# EasyEDA Pro project RAC_schematic_pcb.epro

# Schematic Schematic1
Board Name: Board1; Create Date: 2025-08-06; Page Name: P1; Project Name: RAC_NEW; Schematic Name: Schematic1; Update Date: 2025-08-06; Company: EasyEDA.com; Page Size: A4; Version: V1.0
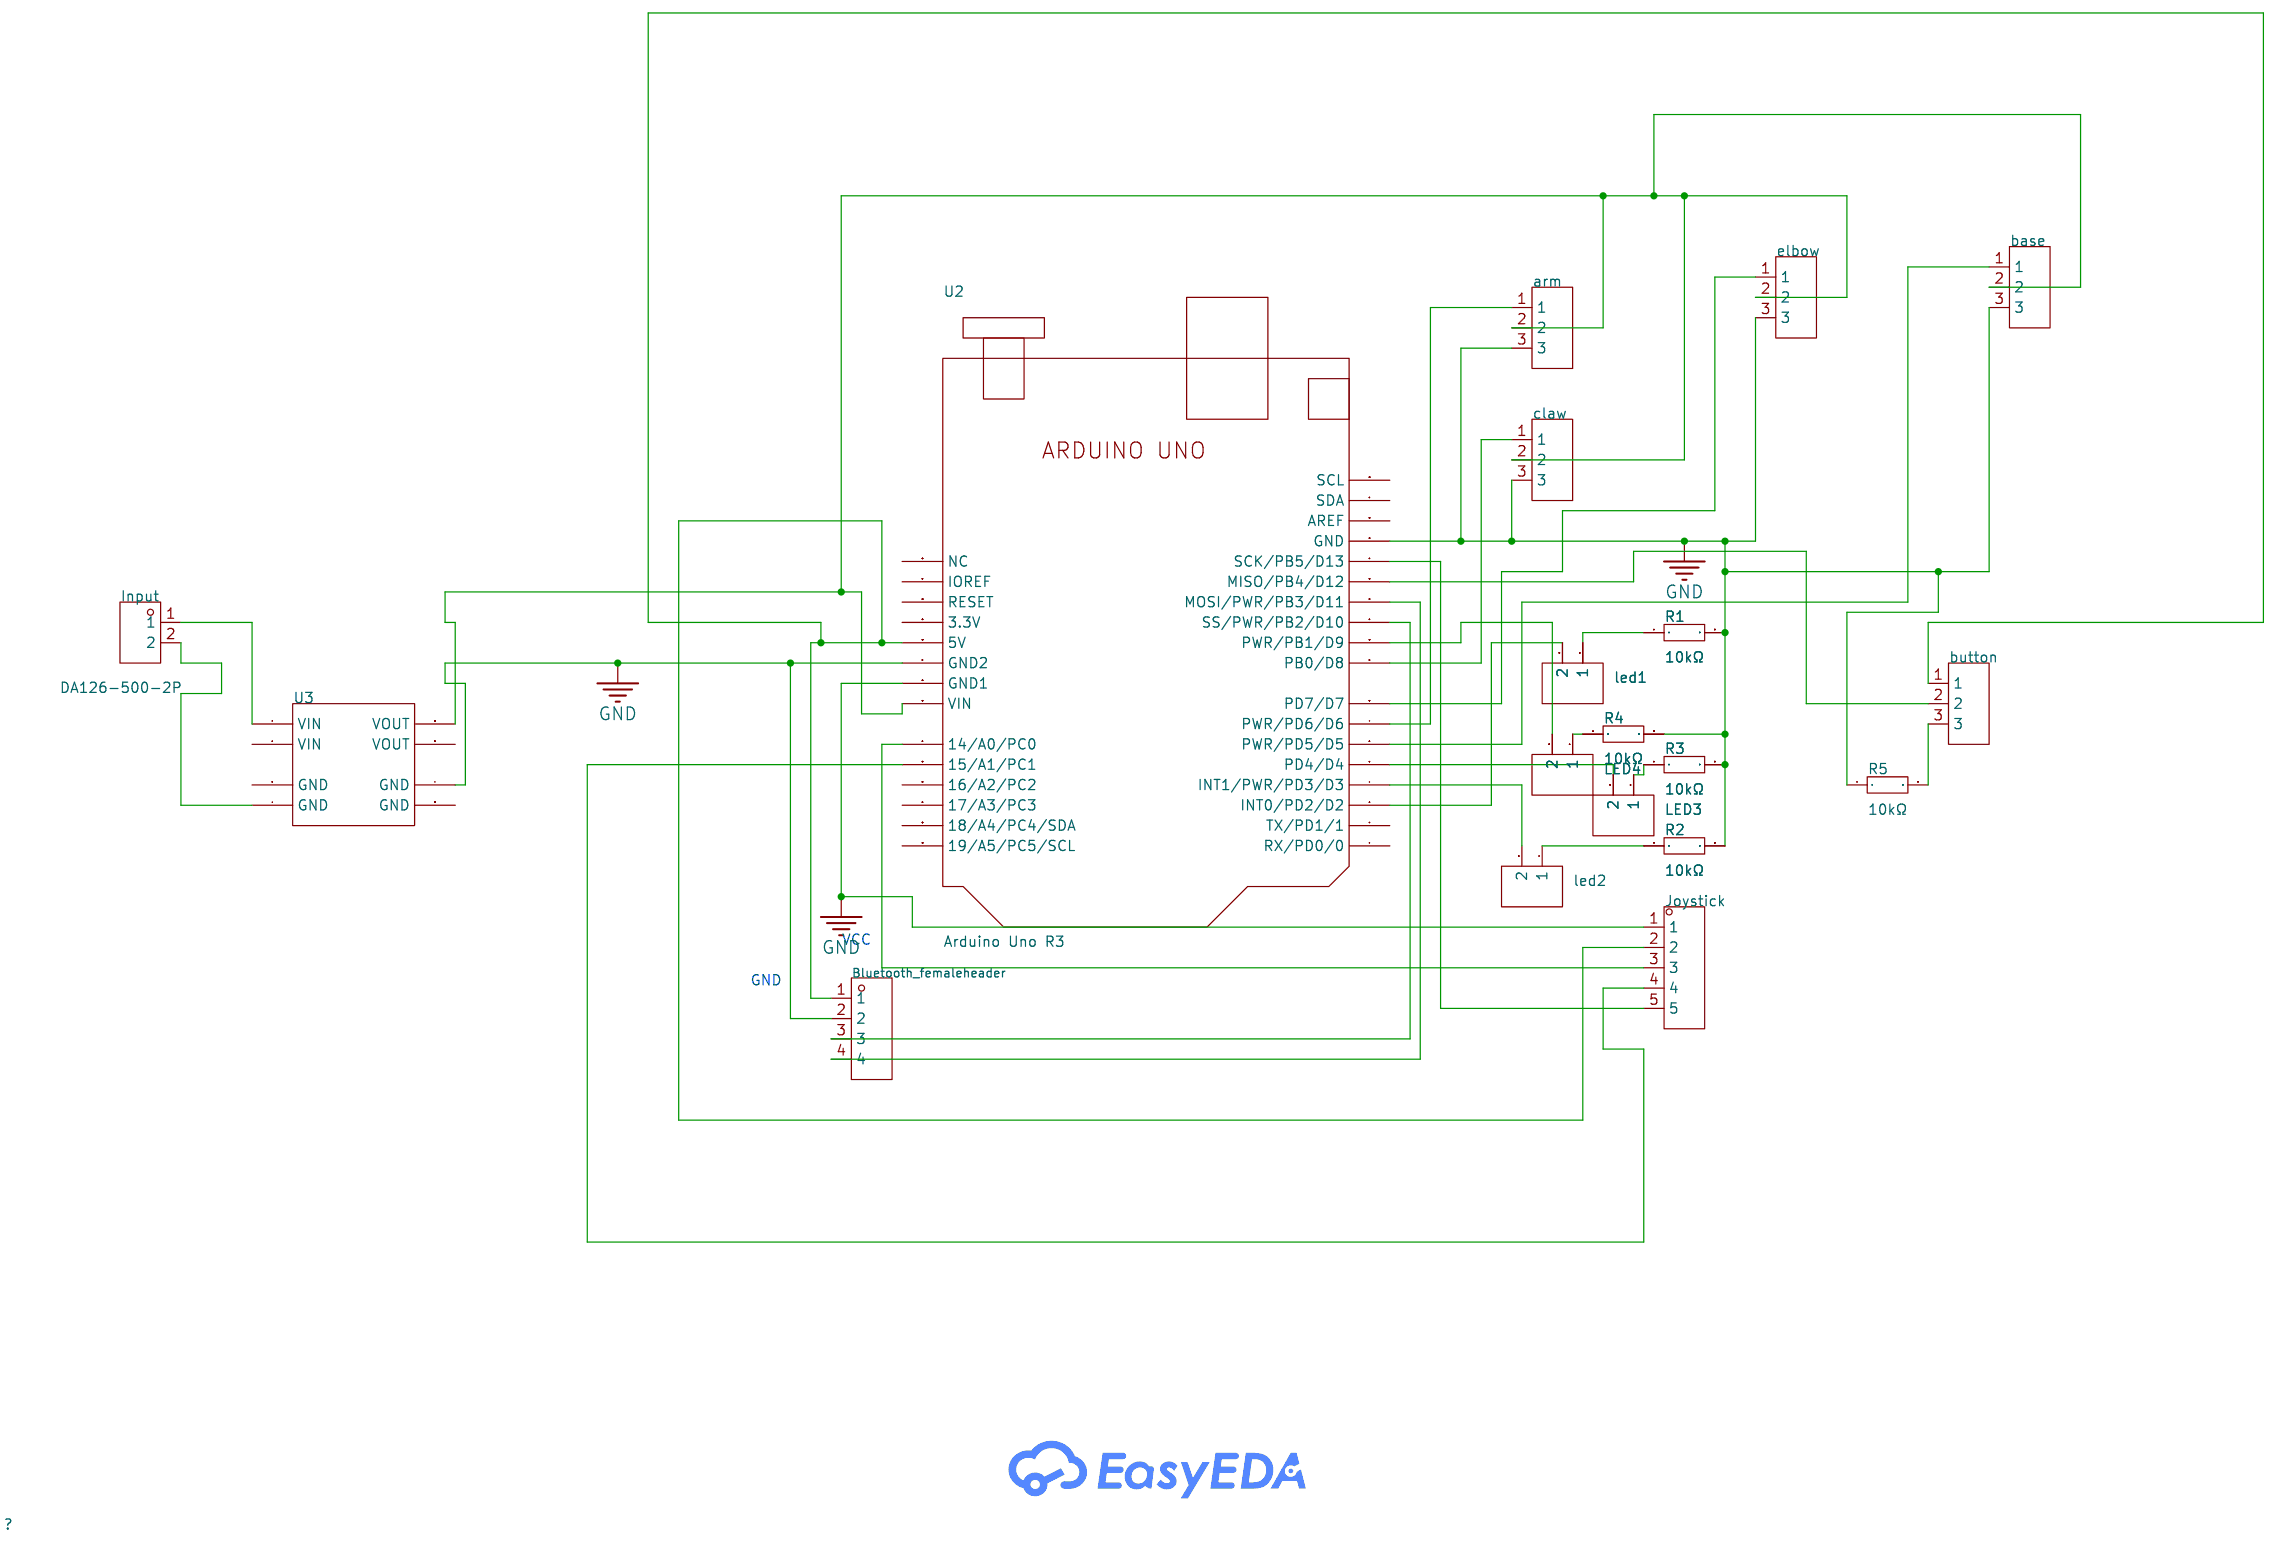
[diagram p0: schematic sheet]

## Parts
arm  -  [HDR-TH_3P-P2.54-V-M]
base  -  [HDR-TH_3P-P2.54-V-M]
Bluetooth_femaleheader  -  [HDR-TH_4P-P2.54-V-F]
button  -  [HDR-TH_3P-P2.54-V-M]
claw  -  [HDR-TH_3P-P2.54-V-M]
elbow  -  [HDR-TH_3P-P2.54-V-M]
Input  DA126-500-2P  [CONN-TH_DA126-500-2P]
Joystick  -  [HDR-TH_5P-P2.54-V-M]
led1  -  [HDR-TH_2P-P2.54-V-F]
led2  -  [HDR-TH_2P-P2.54-V-F]
LED3  -  [HDR-TH_2P-P2.54-V-F]
LED4  -  [HDR-TH_2P-P2.54-V-F]
R1  10kΩ  [R_AXIAL-0.4]
R2  10kΩ  [R_AXIAL-0.4]
R3  10kΩ  [R_AXIAL-0.4]
R4  10kΩ  [R_AXIAL-0.4]
R5  10kΩ  [R_AXIAL-0.4]
U2  Arduino Uno R3  [UNO_R3;WO ARDUINO UNO]
U3  -  [Mini560]

## Library data of the parts
arm base button claw elbow = HDR-M_2.54_1x3P: Supplier Footprint: Through
Bluetooth_femaleheader = HDR-F_2.54_1x4P: Supplier Footprint: Through
Input = DA126-500-2P: Supplier Part: C9900001189; Supplier Footprint: CONN-TH_2P-P5.00; JLCPCB Part Class: Extended Part; Supplier: LCSC
Joystick = HDR-M_2.54_1x5P: Supplier Footprint: Through
led1 led2 LED3 LED4 = HDR-F_2.54_1x2P: Supplier: LCSC; Manufacturer: BOOMELE(博穆精密); Manufacturer Part: 2.54-1*2P母; Supplier Part: C49661; JLCPCB Part Class: Extended Part; Supplier Footprint: Through
R1-R5 = Res_AXIAL-1/4W: Supplier Footprint: Through
U2 = Arduino Uno R3: Manufacturer: Arduino CC
U3 = Mini560

## Nets
GND: arm.3 base.3 Bluetooth_femaleheader.2 claw.3 elbow.3 Joystick.1 R1.2 R2.2 R3.2 R4.2 R5.1 U2.15(GND) U2.26(GND1) U2.27(GND2) U3.7(GND)
$1N1320: Input.1 U3.1(VIN)
$1N1394: Input.2 U3.4(GND)
$1N1925: Bluetooth_femaleheader.1 button.1 Joystick.2 U2.28(5V)
$1N1970: Bluetooth_femaleheader.4 U2.12(MOSI/PWR/PB3/D11)
$1N2111: Joystick.3 U2.24(14/A0/PC0)
$1N2142: Joystick.4 U2.23(15/A1/PC1)
$1N2157: Joystick.5 U2.14(SCK/PB5/D13)
$1N2259: button.3 R5.2
$1N4132: claw.1 U2.9(PB0/D8)
$1N4165: arm.1 U2.7(PWR/PD6/D6)
$1N4198: elbow.1 U2.8(PD7/D7)
$1N4221: base.1 U2.6(PWR/PD5/D5)
$1N4251: Bluetooth_femaleheader.3 U2.11(SS/PWR/PB2/D10)
$1N5269: led1.1 R1.1
$1N5401: LED3.1 R3.1
$1N5705: LED3.2 U2.5(PD4/D4)
$1N5708: led2.2 U2.4(INT1/PWR/PD3/D3)
$1N5816: led2.1 R2.1
$1N5847: LED4.1 R4.1
$1N6180: button.2 U2.13(MISO/PB4/D12)
$1N6211: arm.2 base.2 claw.2 elbow.2 U2.25(VIN) U3.5(VOUT)
$1N6410: led1.2 U2.3(INT0/PD2/D2)
$1N6450: LED4.2 U2.10(PWR/PB1/D9)

Not connected (* = marked no-connect by the designer): U2 1(RX/PD0/0) 2(TX/PD1/1) 16(AREF) 17(SDA) 18(SCL) 19(19/A5/PC5/SCL) 20(18/A4/PC4/SDA) 21(17/A3/PC3) 22(16/A2/PC2) 29(3.3V) 30(RESET) 31(IOREF) 32(NC); U3 2(VIN) 3(GND) 6(VOUT) 8(GND)

## Notes on the sheet
- VCC
- GND

# Board PCB1
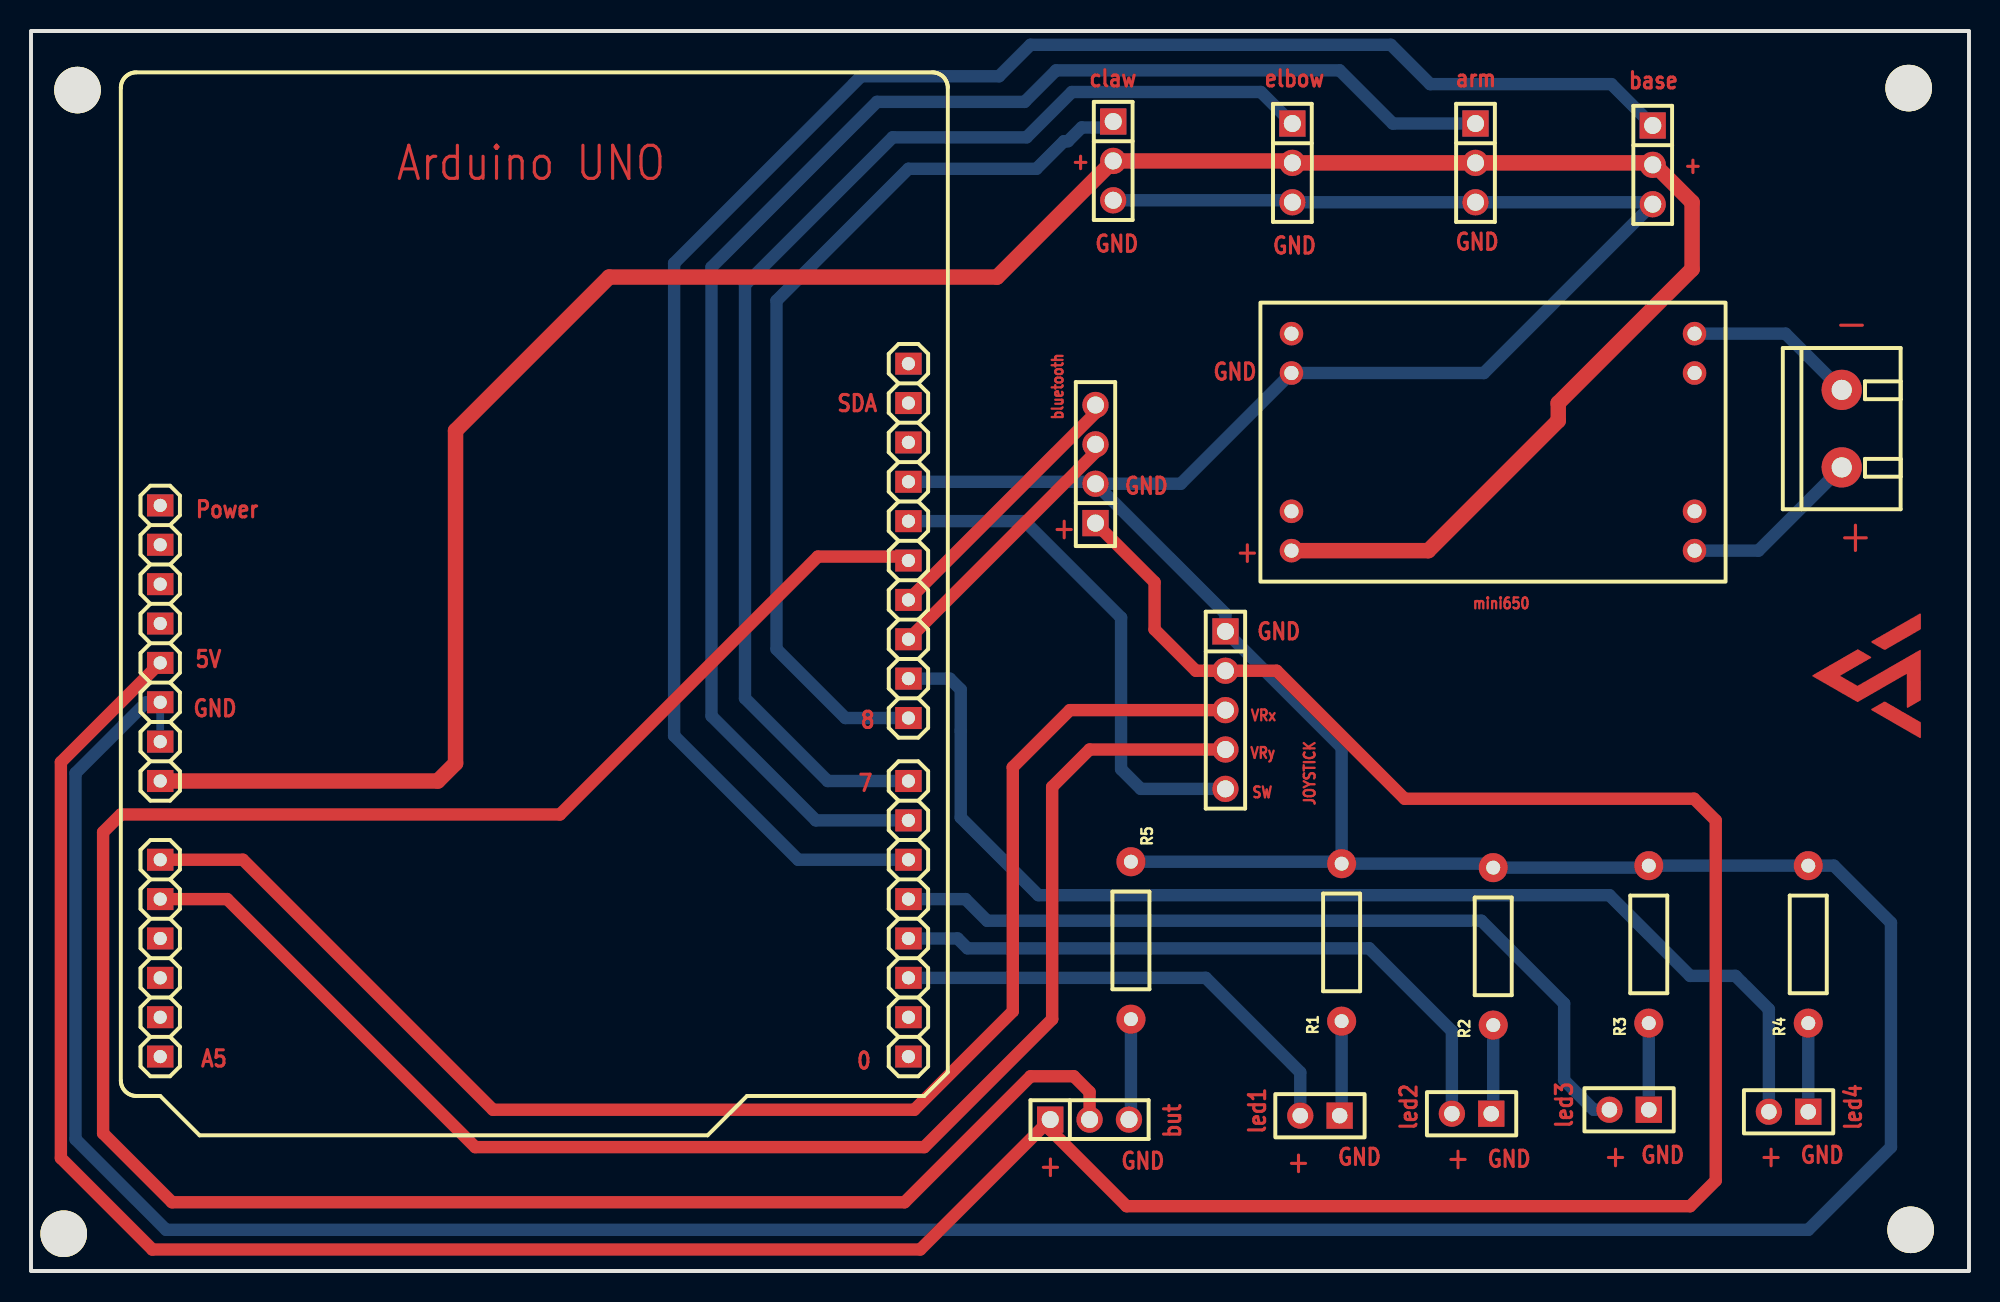
[diagram p1: board, top side]
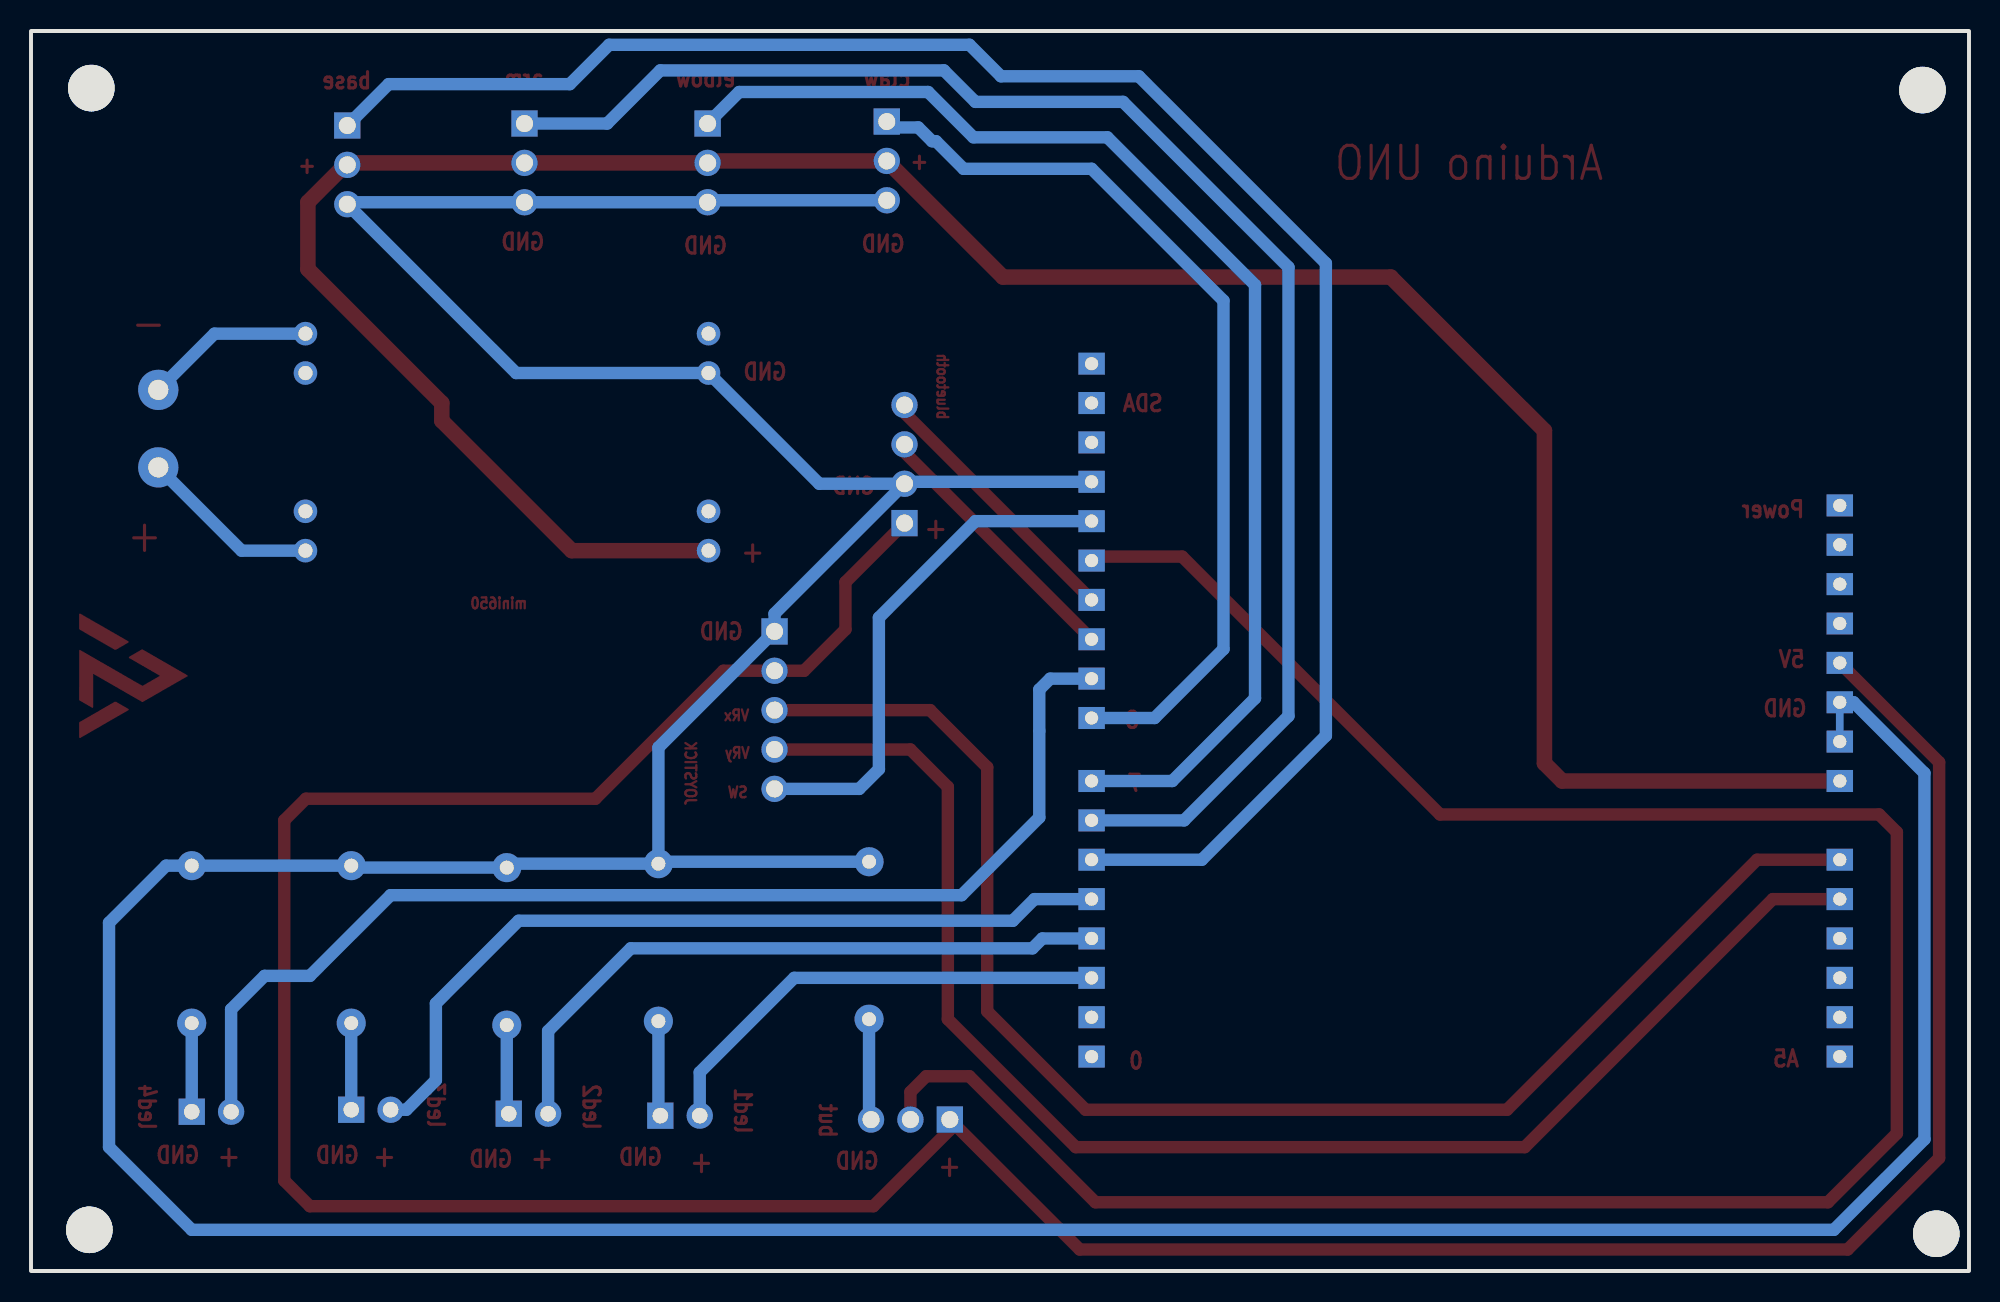
[diagram p2: board, bottom side, seen from below]

Outline 125 x 80 mm; copper layers: Top Layer, Bottom Layer. Coordinates in mm from the lower left corner of the outline.
Outline path: rectangle 0,80 125,0
Stack: Top Layer 0.035mm / Dielectric1 1.51mm FR4 er 4.5 / Bottom Layer 0.035mm

## Design rules (mm)
template: JLCPCB Capability(Two Layers Board)
spacing copperThickness1oz (default): track to track 0.102, other pairs 0.152 to 0.3
spacing copperThickness2oz: track to track 0.203, other pairs 0.152 to 0.3
track width copperThickness1oz (default): min 0.127, default 0.254, max 2.54
track width copperThickness2oz: min 0.203, default 0.254, max 2.54
differential pair differentialPair (default): width min 0.127, default 0.254, max 2.54; gap min 0.152, default 0.152
via viaSize (default): diameter min 0.5, default 0.61, max 10; hole min 0.3, default 0.305, max 6.3

## Placement (name value [footprint] x y rotation side)
arm  -  [HDR-TH_3P-P2.54-V-M]  93.17 71.49 270 top
base  -  [HDR-TH_3P-P2.54-V-M]  104.6 71.36 270 top
Bluetooth_femaleheader  -  [HDR-TH_4P-P2.54-V-F]  68.66 52.06 90 top
button  -  [HDR-TH_3P-P2.54-V-M]  68.28 9.77 0 top
claw  -  [HDR-TH_3P-P2.54-V-M]  69.8 71.62 270 top
elbow  -  [HDR-TH_3P-P2.54-V-M]  81.36 71.49 270 top
Input  DA126-500-2P  [CONN-TH_DA126-500-2P]  116.79 54.35 90 top
Joystick  -  [HDR-TH_5P-P2.54-V-M]  77.04 36.19 270 top
led1  -  [HDR-TH_2P-P2.54-V-F]  83.14 10.02 180 top
led2  -  [HDR-TH_2P-P2.54-V-F]  92.92 10.15 180 top
LED3  -  [HDR-TH_2P-P2.54-V-F]  103.08 10.4 180 top
LED4  -  [HDR-TH_2P-P2.54-V-F]  113.36 10.28 180 top
NOREF  -  [Pad_e15]  3 76.19 0 top
NOREF#2  -  [Pad_e23]  2.11 2.4 0 top
NOREF#3  -  [Pad_e29]  121.24 2.66 0 top
NOREF#4  -  [Pad_e13]  121.11 76.32 0 top
R1  10kΩ  [R_AXIAL-0.4]  84.53 21.2 90 top
R2  10kΩ  [R_AXIAL-0.4]  94.31 20.94 90 top
R3  10kΩ  [R_AXIAL-0.4]  104.35 21.07 90 top
R4  10kΩ  [R_AXIAL-0.4]  114.63 21.07 90 top
R5  10kΩ  [R_AXIAL-0.4]  70.94 21.33 270 top
U2  Arduino Uno R3  [UNO_R3;WO ARDUINO UNO]  32.46 36.19 270 top
U3  -  [Mini560]  94.31 53.58 180 top

## Footprints (pads in the part's own frame, mm; a bottom-side part is the same pattern mirrored in y, then rotated)
CONN-TH_DA126-500-2P
  round 2.6 hole 1.3: 1(-2.5,0) 2(2.5,0)
HDR-TH_2P-P2.54-V-F
  rect 1.7x1.7 hole 1: 1(-1.27,0)
  round 1.7 hole 1: 2(1.27,0)
HDR-TH_3P-P2.54-V-M
  rect 1.7x1.7 hole 1.1: 1(-2.54,0)
  round 1.7 hole 1.1: 2(0,0) 3(2.54,0)
HDR-TH_4P-P2.54-V-F
  rect 1.7x1.7 hole 1.1: 1(-3.81,0)
  round 1.7 hole 1.1: 2(-1.27,0) 3(1.27,0) 4(3.81,0)
HDR-TH_5P-P2.54-V-M
  rect 1.7x1.7 hole 1.1: 1(-5.08,0)
  round 1.7 hole 1.1: 2(-2.54,0) 3(0,0) 4(2.54,0) 5(5.08,0)
Mini560
  round 1.524 hole 0.914: 1(-12.986,7.11) 2(-12.986,4.57) 3(-12.986,-4.35) 4(-12.986,-6.89) 5(13.014,7.11) 6(13.014,4.57) 7(13.014,-4.35) 8(13.014,-6.89)
Pad_e13
  round 3 hole 5x3: 1(0,0)
Pad_e15
  round 3 hole 5x3: 1(0,0)
Pad_e23
  round 3 hole 3: 1(0,0)
Pad_e29
  round 3 hole 3: 1(0,0)
R_AXIAL-0.4
  round 1.879 hole 0.899: 1(-5.08,0) 2(5.08,0)
UNO_R3;WO ARDUINO UNO
  rect 1.423x1.707 hole 0.849: 1(22.352,24.13) 2(19.812,24.13) 3(17.272,24.13) 4(14.732,24.13) 5(12.192,24.13) 6(9.652,24.13) 7(7.112,24.13) 8(4.572,24.13) 9(0.508,24.13) 10(-2.032,24.13) 11(-4.572,24.13) 12(-7.112,24.13) 13(-9.652,24.13) 14(-12.192,24.13) 15(-14.732,24.13) 16(-17.272,24.13) 17(-19.812,24.13) 18(-22.352,24.13) 19(22.352,-24.13) 20(19.812,-24.13) 21(17.272,-24.13) 22(14.732,-24.13) 23(12.192,-24.13) 24(9.652,-24.13) 25(4.572,-24.13) 26(2.032,-24.13) 27(-0.508,-24.13) 28(-3.048,-24.13) 29(-5.588,-24.13) 30(-8.128,-24.13) 31(-10.668,-24.13) 32(-13.208,-24.13)

## Nets
As in the schematic.

Pads without a net: NOREF 1; NOREF#2 1; NOREF#3 1; NOREF#4 1; U2 1 2 16 17 18 19 20 21 22 29 30 31 32; U3 2 3 6 8

## Routing (per net, layer and track width the routed paths; a pad name or vN(x,y) marks a point on that pad's centre or on a via; arc(x,y) is an arc through that point)
GND: length 342
  Bottom Layer w0.5: U2.27 U2.26
  Bottom Layer w0.8: R1.2 84.41,26.41 R5.1 ; R1.2 84.53,33.77 Joystick.1 77.04,42.41 Bluetooth_femaleheader.2 ; R1.2 94.06,26.28 R2.2 104.22,26.03 R3.2 R4.2 116.28,26.15 119.97,22.47 119.97,7.99 114.63,2.66 8.72,2.66 2.87,8.5 2.87,32.12 7.44,36.69 U2.27 ; U2.15 68.53,50.92 Bluetooth_femaleheader.2 ; Bluetooth_femaleheader.2 74.16,50.79 81.3,57.93 93.71,57.93 base.3 104.47,68.95 arm.3 elbow.3 81.23,69.08 claw.3
$1N1320: length 11.7
  Bottom Layer w0.8: Input.1 111.42,46.47 107.3,46.47
$1N1394: length 11
  Bottom Layer w0.8: 107.3,60.47 113.16,60.47 Input.2
$1N1925: length 223.6
  Top Layer w0.8: Bluetooth_femaleheader.1 72.47,44.44 72.47,41.39 75.14,38.72 80.34,38.72 88.6,30.47 107.27,30.47 108.66,29.07 108.66,5.83 107.01,4.18 70.66,4.18 65.74,9.11 button.1 57.36,1.39 7.83,1.39 1.93,7.29 1.93,32.83 U2.28
$1N1970: length 17.6
  Top Layer w0.8: U2.12 68.66,55.36 Bluetooth_femaleheader.4
$1N2111: length 95.3
  Top Layer w0.8: Joystick.3 67.01,36.19 63.32,32.5 63.32,16.75 56.97,10.4 29.8,10.4 13.67,26.53 U2.24
$1N2142: length 94.7
  Top Layer w0.8: Joystick.4 68.28,33.64 65.87,31.23 65.87,16.25 57.61,7.99 28.65,7.99 12.65,23.99 U2.23
$1N2157: length 33.3
  Bottom Layer w0.8: 56.59,48.38 64.09,48.38 70.31,42.15 70.31,32.38 71.58,31.11 Joystick.5
$1N2259: length 6.5
  Bottom Layer w0.8: button.3 70.94,9.9 R5.2
$1N4132: length 59.3
  Bottom Layer w0.8: U2.9 52.53,35.68 48.09,40.12 48.09,62.6 56.59,71.11 64.85,71.11 66.63,72.89 66.88,72.89 67.77,73.78 69.42,73.78 claw.1
$1N4165: length 100.4
  Bottom Layer w0.8: arm.1 87.84,74.03 84.41,77.46 66.12,77.46 64.09,75.43 54.56,75.43 43.89,64.76 43.89,35.8 50.62,29.07 56.59,29.07
$1N4198: length 80.7
  Bottom Layer w0.8: U2.8 51.39,31.61 46.05,36.95 46.05,63.62 55.58,73.14 64.21,73.14 67.13,76.06 79.33,76.06 elbow.1
$1N4221: length 120
  Bottom Layer w0.8: base.1 101.93,76.57 90.25,76.57 87.71,79.11 64.47,79.11 62.44,77.08 53.55,77.08 41.48,65.01 41.48,34.53 49.48,26.53 U2.6
$1N4251: length 17.6
  Top Layer w0.8: U2.11 68.66,52.82 Bluetooth_femaleheader.3
$1N5269: length 6.1
  Bottom Layer w0.8: led1.1 84.53,10.15 R1.1
$1N5401: length 5.6
  Bottom Layer w0.8: R3.1 LED3.1
$1N5705: length 53.7
  Bottom Layer w0.8: LED3.2 100.79,10.4 98.88,12.31 98.88,17.26 93.55,22.6 61.67,22.6 60.28,23.99 U2.5
$1N5708: length 42.9
  Bottom Layer w0.8: U2.4 59.77,21.45 60.4,20.82 86.31,20.82 91.65,15.48 led2.2
$1N5816: length 5.8
  Bottom Layer w0.8: R2.1 94.31,10.28 led2.1
$1N5847: length 5.7
  Bottom Layer w0.8: R4.1 LED4.1
$1N6180: length 149.9
  Top Layer w0.8: button.2 68.28,11.55 67.26,12.56 64.47,12.56 56.35,4.44 9.1,4.44 4.65,8.88 4.65,28.31 5.79,29.45 34.11,29.45 50.75,46.09 56.34,46.09 U2.13
$1N6211: length 167.4
  Top Layer w1: U2.25 26.24,31.61 27.38,32.76 27.38,54.22 37.29,64.12 62.31,64.12 claw.2 81.23,71.62 elbow.2 arm.2 104.47,71.49 base.2 104.73,71.36 107.14,68.95 107.14,64.63 98.5,56 98.5,54.85 90.12,46.47 81.3,46.47
$1N6410: length 30.6
  Bottom Layer w0.8: U2.3 75.77,18.91 81.87,12.82 led1.2
$1N6450: length 75.8
  Bottom Layer w0.8: U2.10 59.26,38.22 59.97,37.51 59.97,29.26 64.98,24.25 101.81,24.25 107.01,19.04 109.93,19.04 112.09,16.88 LED4.2

Small or netless copper shapes (teardrops, artwork), in the pictures only: 3 on Top Layer

## Text on the board
Top Layer: VRy | VRx | SW | mini650 | bluetooth | JOYSTICK | GND | 5V | Power | A5 | SDA | 0 | 7 | 8 | + | claw | elbow | arm | base | but | led1 | led2 | led3 | led4 | Arduino UNO | -
